# Altium schematic sheet ZynqDDR.SchDoc: =TITLE
size A3; DocumentNumber: 8; SheetNumber: 8; SheetTotal: 11
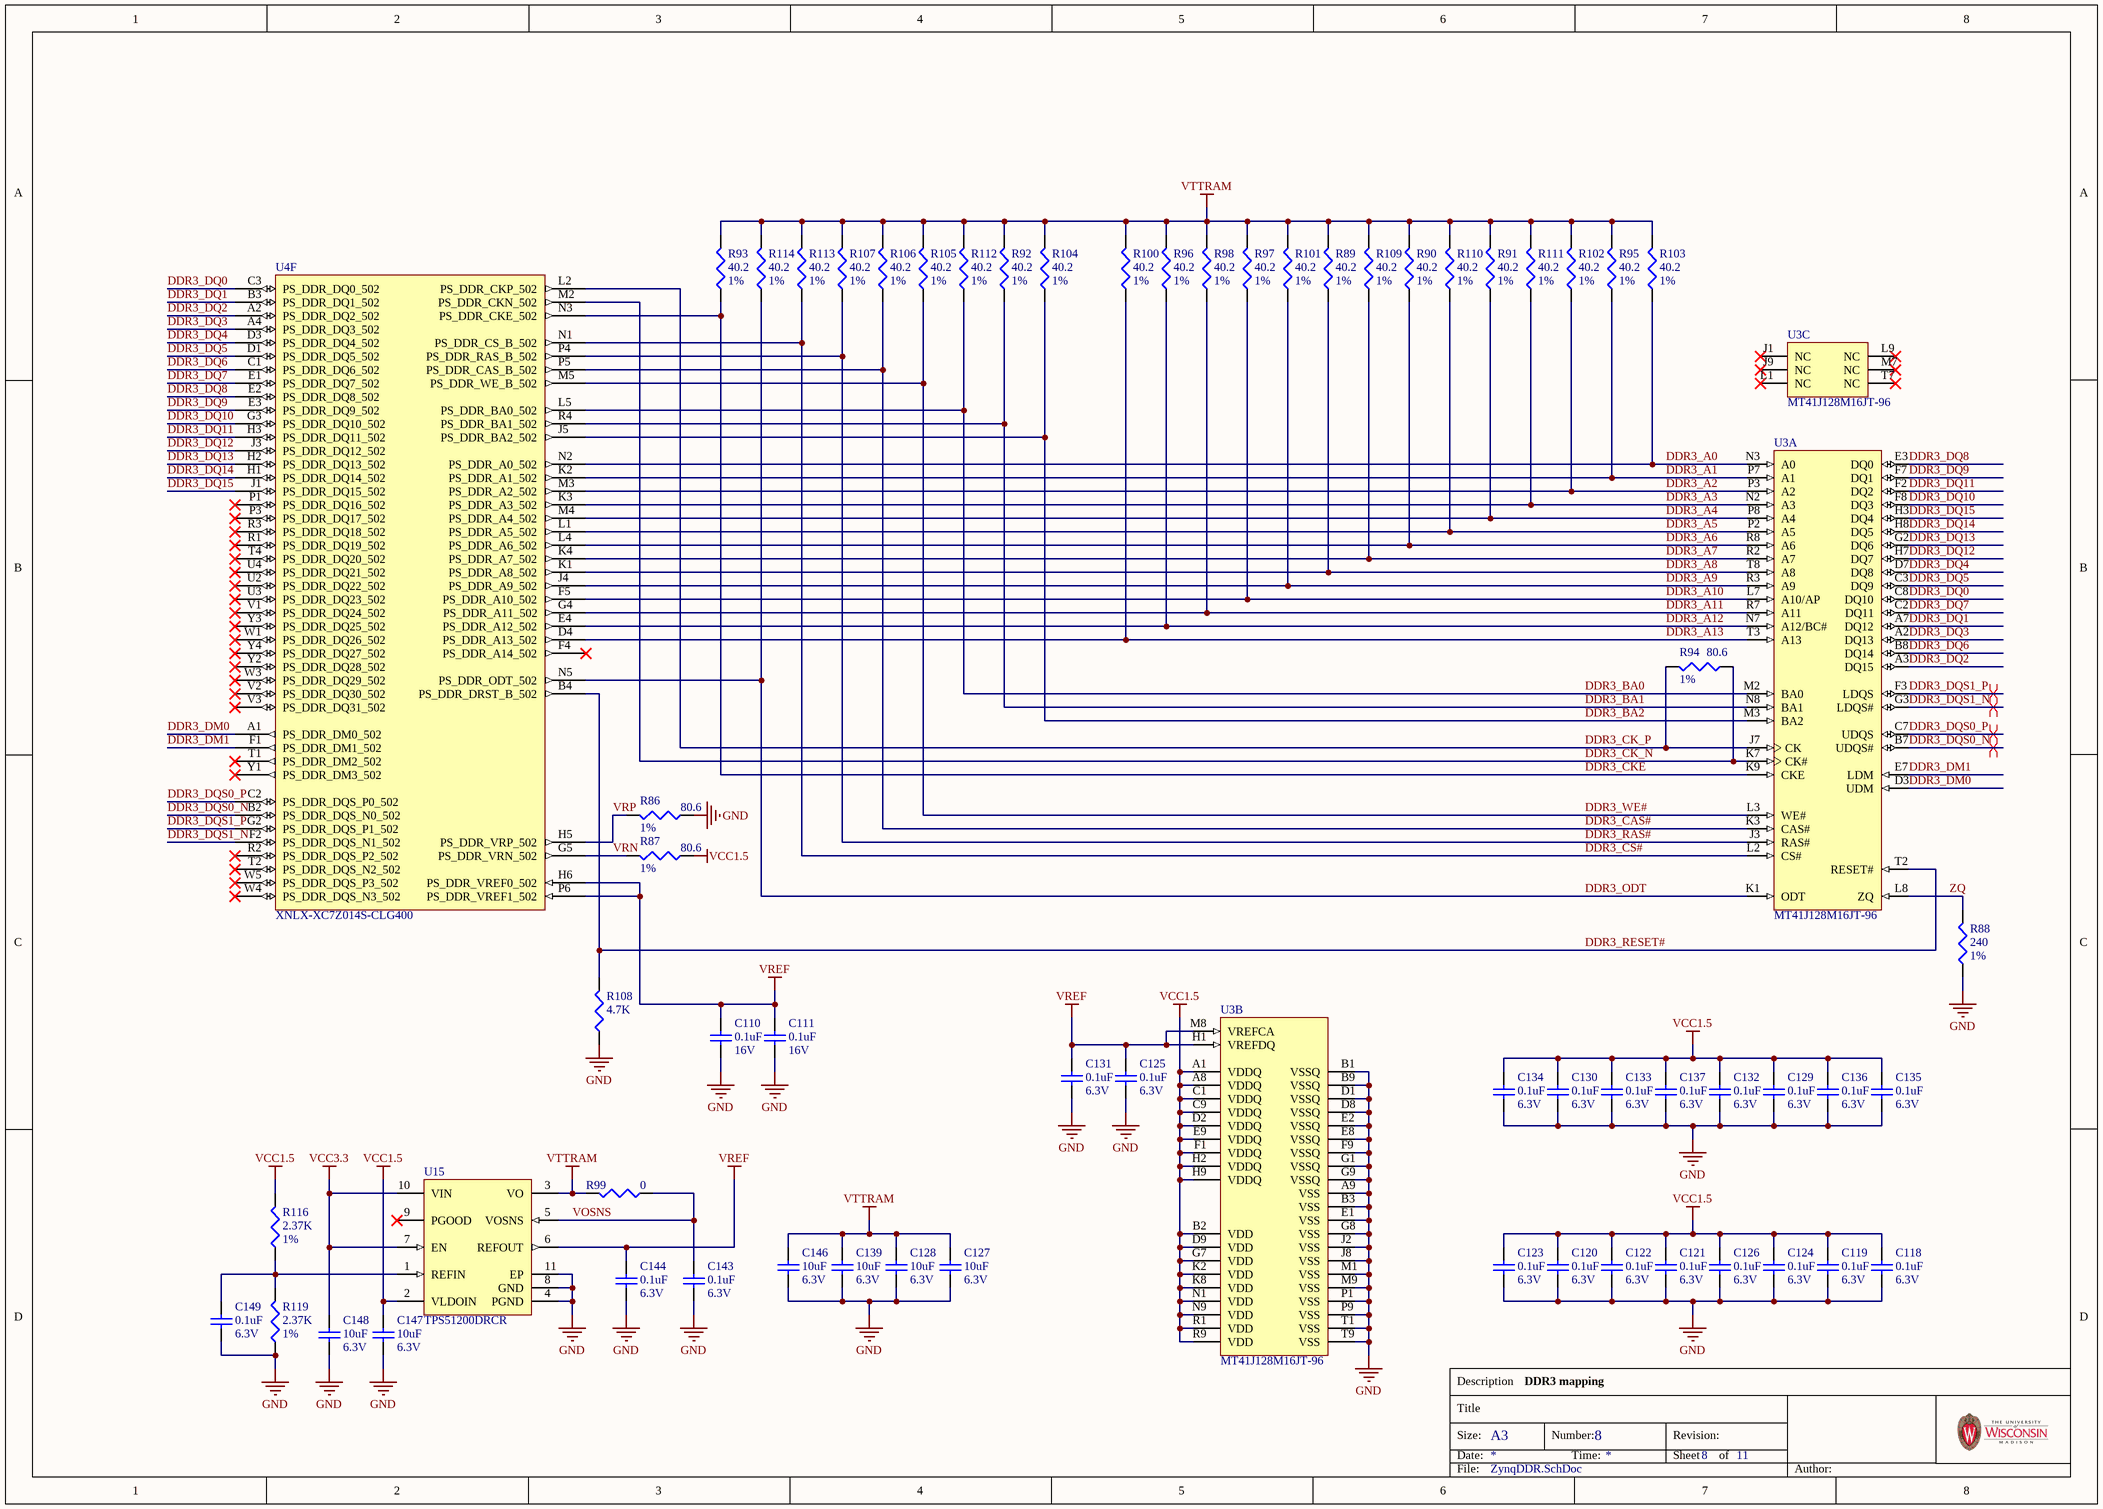
[diagram p0: ZynqDDR.SchDoc]

## Parts
C110  value 0.1uF  Rating: 16V  [C0402_IPC_H]  (hidden comment: ?)
C111  value 0.1uF  Rating: 16V  [C0402_IPC_H]  (hidden comment: ?)
C118  value 0.1uF  Rating: 6.3V  [C0201_IPC_H]  (hidden comment: ?)
C119  value 0.1uF  Rating: 6.3V  [C0201_IPC_H]  (hidden comment: ?)
C120  value 0.1uF  Rating: 6.3V  [C0201_IPC_H]  (hidden comment: ?)
C121  value 0.1uF  Rating: 6.3V  [C0201_IPC_H]  (hidden comment: ?)
C122  value 0.1uF  Rating: 6.3V  [C0201_IPC_H]  (hidden comment: ?)
C123  value 0.1uF  Rating: 6.3V  [C0201_IPC_H]  (hidden comment: ?)
C124  value 0.1uF  Rating: 6.3V  [C0201_IPC_H]  (hidden comment: ?)
C125  value 0.1uF  Rating: 6.3V  [C0201_IPC_H]  (hidden comment: ?)
C126  value 0.1uF  Rating: 6.3V  [C0201_IPC_H]  (hidden comment: ?)
C127  value 10uF  Rating: 6.3V  [C0402_IPC_H]  (hidden comment: ?)
C128  value 10uF  Rating: 6.3V  [C0402_IPC_H]  (hidden comment: ?)
C129  value 0.1uF  Rating: 6.3V  [C0201_IPC_H]  (hidden comment: ?)
C130  value 0.1uF  Rating: 6.3V  [C0201_IPC_H]  (hidden comment: ?)
C131  value 0.1uF  Rating: 6.3V  [C0201_IPC_H]  (hidden comment: ?)
C132  value 0.1uF  Rating: 6.3V  [C0201_IPC_H]  (hidden comment: ?)
C133  value 0.1uF  Rating: 6.3V  [C0201_IPC_H]  (hidden comment: ?)
C134  value 0.1uF  Rating: 6.3V  [C0201_IPC_H]  (hidden comment: ?)
C135  value 0.1uF  Rating: 6.3V  [C0201_IPC_H]  (hidden comment: ?)
C136  value 0.1uF  Rating: 6.3V  [C0201_IPC_H]  (hidden comment: ?)
C137  value 0.1uF  Rating: 6.3V  [C0201_IPC_H]  (hidden comment: ?)
C139  value 10uF  Rating: 6.3V  [C0402_IPC_H]  (hidden comment: ?)
C143  value 0.1uF  Rating: 6.3V  [C0201_IPC_H]  (hidden comment: ?)
C144  value 0.1uF  Rating: 6.3V  [C0201_IPC_H]  (hidden comment: ?)
C146  value 10uF  Rating: 6.3V  [C0402_IPC_H]  (hidden comment: ?)
C147  value 10uF  Rating: 6.3V  [C0402_IPC_H]  (hidden comment: ?)
C148  value 10uF  Rating: 6.3V  [C0402_IPC_H]  (hidden comment: ?)
C149  value 0.1uF  Rating: 6.3V  [C0201_IPC_H]  (hidden comment: ?)
R86  value 80.6  Tolerance: 1%  [R0402_IPC_H]  (hidden comment: ?)
R87  value 80.6  Tolerance: 1%  [R0402_IPC_H]  (hidden comment: ?)
R88  value 240  Tolerance: 1%  [R0402_IPC_H]  (hidden comment: ?)
R89  value 40.2  Tolerance: 1%  [R0201_IPC_H]  (hidden comment: ?)
R90  value 40.2  Tolerance: 1%  [R0201_IPC_H]  (hidden comment: ?)
R91  value 40.2  Tolerance: 1%  [R0201_IPC_H]  (hidden comment: ?)
R92  value 40.2  Tolerance: 1%  [R0201_IPC_H]  (hidden comment: ?)
R93  value 40.2  Tolerance: 1%  [R0201_IPC_H]  (hidden comment: ?)
R94  value 80.6  Tolerance: 1%  [R0402_IPC_H]  (hidden comment: ?)
R95  value 40.2  Tolerance: 1%  [R0201_IPC_H]  (hidden comment: ?)
R96  value 40.2  Tolerance: 1%  [R0201_IPC_H]  (hidden comment: ?)
R97  value 40.2  Tolerance: 1%  [R0201_IPC_H]  (hidden comment: ?)
R98  value 40.2  Tolerance: 1%  [R0201_IPC_H]  (hidden comment: ?)
R99  value 0  [R0402_IPC_H]  (hidden comment: ?)
R100  value 40.2  Tolerance: 1%  [R0201_IPC_H]  (hidden comment: ?)
R101  value 40.2  Tolerance: 1%  [R0201_IPC_H]  (hidden comment: ?)
R102  value 40.2  Tolerance: 1%  [R0201_IPC_H]  (hidden comment: ?)
R103  value 40.2  Tolerance: 1%  [R0201_IPC_H]  (hidden comment: ?)
R104  value 40.2  Tolerance: 1%  [R0201_IPC_H]  (hidden comment: ?)
R105  value 40.2  Tolerance: 1%  [R0201_IPC_H]  (hidden comment: ?)
R106  value 40.2  Tolerance: 1%  [R0201_IPC_H]  (hidden comment: ?)
R107  value 40.2  Tolerance: 1%  [R0201_IPC_H]  (hidden comment: ?)
R108  value 4.7K  [R0402_IPC_H]  (hidden comment: ?)
R109  value 40.2  Tolerance: 1%  [R0201_IPC_H]  (hidden comment: ?)
R110  value 40.2  Tolerance: 1%  [R0201_IPC_H]  (hidden comment: ?)
R111  value 40.2  Tolerance: 1%  [R0201_IPC_H]  (hidden comment: ?)
R112  value 40.2  Tolerance: 1%  [R0201_IPC_H]  (hidden comment: ?)
R113  value 40.2  Tolerance: 1%  [R0201_IPC_H]  (hidden comment: ?)
R114  value 40.2  Tolerance: 1%  [R0201_IPC_H]  (hidden comment: ?)
R116  value 2.37K  Tolerance: 1%  [R0402_IPC_H]  (hidden comment: ?)
R119  value 2.37K  Tolerance: 1%  [R0402_IPC_H]  (hidden comment: ?)
U3  MT41J128M16JT-96  [MICT-JT-96]  (parts A,B,C of 3)
U4  XNLX-XC7Z014S-CLG400  [CLG400]  (part F of 9)
U15  TPS51200DRCR  [DRC0010J_V]

## Nets
GND: C110.1 C111.1 C118.2 C119.2 C120.2 C121.2 C122.2 C123.2 C124.2 C125.1 C126.2 C127.1 C128.1 C129.2 C130.2 C131.1 C132.2 C133.2 C134.2 C135.2 C136.2 C137.2 C139.1 C143.1 C144.1 C146.1 C147.1 C148.1 C149.1 R86.1 R88.1 R108.1 R119.1 U3.A9(VSS) U3.B1(VSSQ) U3.B3(VSS) U3.B9(VSSQ) U3.D1(VSSQ) U3.D8(VSSQ) U3.E1(VSS) U3.E2(VSSQ) U3.E8(VSSQ) U3.F9(VSSQ) U3.G1(VSSQ) U3.G8(VSS) U3.G9(VSSQ) U3.J2(VSS) U3.J8(VSS) U3.M1(VSS) U3.M9(VSS) U3.P1(VSS) U3.P9(VSS) U3.T1(VSS) U3.T9(VSS) U15.4(PGND) U15.8(GND) U15.11(EP)
VCC1.5: C118.1 C119.1 C120.1 C121.1 C122.1 C123.1 C124.1 C126.1 C129.1 C130.1 C132.1 C133.1 C134.1 C135.1 C136.1 C137.1 C147.2 R87.1 R116.2 U3.A1(VDDQ) U3.A8(VDDQ) U3.B2(VDD) U3.C1(VDDQ) U3.C9(VDDQ) U3.D2(VDDQ) U3.D9(VDD) U3.E9(VDDQ) U3.F1(VDDQ) U3.G7(VDD) U3.H2(VDDQ) U3.H9(VDDQ) U3.K2(VDD) U3.K8(VDD) U3.N1(VDD) U3.N9(VDD) U3.R1(VDD) U3.R9(VDD) U15.2(VLDOIN)
VCC3.3: C148.2 U15.7(EN) U15.10(VIN)
VREF: C110.2 C111.2 C125.2 C131.2 C144.2 U3.H1(VREFDQ) U3.M8(VREFCA) U4.H6(PS_DDR_VREF0_502) U4.P6(PS_DDR_VREF1_502) U15.6(REFOUT)
VTTRAM: C127.2 C128.2 C139.2 C146.2 R89.2 R90.2 R91.2 R92.2 R93.2 R95.2 R96.2 R97.2 R98.2 R99.2 R100.2 R101.2 R102.2 R103.2 R104.2 R105.2 R106.2 R107.2 R109.2 R110.2 R111.2 R112.2 R113.2 R114.2 U15.3(VO)
DDR3_A0: R103.1 U3.N3(A0) U4.N2(PS_DDR_A0_502)
DDR3_A1: R95.1 U3.P7(A1) U4.K2(PS_DDR_A1_502)
DDR3_A2: R102.1 U3.P3(A2) U4.M3(PS_DDR_A2_502)
DDR3_A3: R111.1 U3.N2(A3) U4.K3(PS_DDR_A3_502)
DDR3_A4: R91.1 U3.P8(A4) U4.M4(PS_DDR_A4_502)
DDR3_A5: R110.1 U3.P2(A5) U4.L1(PS_DDR_A5_502)
DDR3_A6: R90.1 U3.R8(A6) U4.L4(PS_DDR_A6_502)
DDR3_A7: R109.1 U3.R2(A7) U4.K4(PS_DDR_A7_502)
DDR3_A8: R89.1 U3.T8(A8) U4.K1(PS_DDR_A8_502)
DDR3_A9: R101.1 U3.R3(A9) U4.J4(PS_DDR_A9_502)
DDR3_A10: R97.1 U3.L7(A10/AP) U4.F5(PS_DDR_A10_502)
DDR3_A11: R98.1 U3.R7(A11) U4.G4(PS_DDR_A11_502)
DDR3_A12: R96.1 U3.N7(A12/BC#) U4.E4(PS_DDR_A12_502)
DDR3_A13: R100.1 U3.T3(A13) U4.D4(PS_DDR_A13_502)
DDR3_BA0: R112.1 U3.M2(BA0) U4.L5(PS_DDR_BA0_502)
DDR3_BA1: R92.1 U3.N8(BA1) U4.R4(PS_DDR_BA1_502)
DDR3_BA2: R104.1 U3.M3(BA2) U4.J5(PS_DDR_BA2_502)
DDR3_CAS#: R106.1 U3.K3(CAS#) U4.P5(PS_DDR_CAS_B_502)
DDR3_CK_N: R94.1 U3.K7(CK#) U4.M2(PS_DDR_CKN_502)
DDR3_CK_P: R94.2 U3.J7(CK) U4.L2(PS_DDR_CKP_502)
DDR3_CKE: R93.1 U3.K9(CKE) U4.N3(PS_DDR_CKE_502)
DDR3_CS#: R113.1 U3.L2(CS#) U4.N1(PS_DDR_CS_B_502)
DDR3_DM0: U3.D3(UDM) U4.A1(PS_DDR_DM0_502)
DDR3_DM1: U3.E7(LDM) U4.F1(PS_DDR_DM1_502)
DDR3_DQ0: U3.C8(DQ10) U4.C3(PS_DDR_DQ0_502)
DDR3_DQ1: U3.A7(DQ12) U4.B3(PS_DDR_DQ1_502)
DDR3_DQ2: U3.A3(DQ15) U4.A2(PS_DDR_DQ2_502)
DDR3_DQ3: U3.A2(DQ13) U4.A4(PS_DDR_DQ3_502)
DDR3_DQ4: U3.D7(DQ8) U4.D3(PS_DDR_DQ4_502)
DDR3_DQ5: U3.C3(DQ9) U4.D1(PS_DDR_DQ5_502)
DDR3_DQ6: U3.B8(DQ14) U4.C1(PS_DDR_DQ6_502)
DDR3_DQ7: U3.C2(DQ11) U4.E1(PS_DDR_DQ7_502)
DDR3_DQ8: U3.E3(DQ0) U4.E2(PS_DDR_DQ8_502)
DDR3_DQ9: U3.F7(DQ1) U4.E3(PS_DDR_DQ9_502)
DDR3_DQ10: U3.F8(DQ3) U4.G3(PS_DDR_DQ10_502)
DDR3_DQ11: U3.F2(DQ2) U4.H3(PS_DDR_DQ11_502)
DDR3_DQ12: U3.H7(DQ7) U4.J3(PS_DDR_DQ12_502)
DDR3_DQ13: U3.G2(DQ6) U4.H2(PS_DDR_DQ13_502)
DDR3_DQ14: U3.H8(DQ5) U4.H1(PS_DDR_DQ14_502)
DDR3_DQ15: U3.H3(DQ4) U4.J1(PS_DDR_DQ15_502)
DDR3_DQS0_N: U3.B7(UDQS#) U4.B2(PS_DDR_DQS_N0_502)
DDR3_DQS0_P: U3.C7(UDQS) U4.C2(PS_DDR_DQS_P0_502)
DDR3_DQS1_N: U3.G3(LDQS#) U4.F2(PS_DDR_DQS_N1_502)
DDR3_DQS1_P: U3.F3(LDQS) U4.G2(PS_DDR_DQS_P1_502)
DDR3_ODT: R114.1 U3.K1(ODT) U4.N5(PS_DDR_ODT_502)
DDR3_RAS#: R107.1 U3.J3(RAS#) U4.P4(PS_DDR_RAS_B_502)
DDR3_RESET#: R108.2 U3.T2(RESET#) U4.B4(PS_DDR_DRST_B_502)
DDR3_WE#: R105.1 U3.L3(WE#) U4.M5(PS_DDR_WE_B_502)
VOSNS: C143.2 R99.1 U15.5(VOSNS)
VRN: R87.2 U4.G5(PS_DDR_VRN_502)
VRP: R86.2 U4.H5(PS_DDR_VRP_502)
ZQ: R88.2 U3.L8(ZQ)
NetC149_2: C149.2 R116.1 R119.2 U15.1(REFIN)

Not connected (* = marked no-connect by the designer): U3 J1(NC)* J9(NC)* L1(NC)* L9(NC)* M7(NC)* T7(NC)*; U4 F4(PS_DDR_A14_502)* P1(PS_DDR_DQ16_502)* P3(PS_DDR_DQ17_502)* R1(PS_DDR_DQ19_502)* R2(PS_DDR_DQS_P2_502)* R3(PS_DDR_DQ18_502)* T1(PS_DDR_DM2_502)* T2(PS_DDR_DQS_N2_502)* T4(PS_DDR_DQ20_502)* U2(PS_DDR_DQ22_502)* U3(PS_DDR_DQ23_502)* U4(PS_DDR_DQ21_502)* V1(PS_DDR_DQ24_502)* V2(PS_DDR_DQ30_502)* V3(PS_DDR_DQ31_502)* W1(PS_DDR_DQ26_502)* W3(PS_DDR_DQ29_502)* W4(PS_DDR_DQS_N3_502)* W5(PS_DDR_DQS_P3_502)* Y1(PS_DDR_DM3_502)* Y2(PS_DDR_DQ28_502)* Y3(PS_DDR_DQ25_502)* Y4(PS_DDR_DQ27_502)*; U15 9(PGOOD)*

## Layout directives
differential pair: DDR3_DQS0_N, DDR3_DQS0_P, DDR3_DQS1_N, DDR3_DQS1_P

## Notes on the sheet
- DDR3 mapping
- Description
- Title
- Size:
- Date:
- A3
- Number:
- Time:
- Revision:
- Sheet
- of
- File:
- Author:

## Library data of the parts
C110 C111 = Cap: Capacitor; Manufacturer: Murata; Part: GRM155R71C104KA88D; INVKEY: CP0402-0.1UF-16V-10%; PackageDescription: Chip Capacitor
C118-C126 C129-C137 C143 C144 C149 = Cap: Capacitor; Manufacturer: Murata; Part: GRM033R60J104KE19D; INVKEY: CP0201-0.1UF-6.3V-10%; PackageDescription: Chip Capacitor
C127 C128 C139 C146-C148 = Cap: Capacitor; Manufacturer: Murata; Part: GRM155R60J106ME44D; INVKEY: CP0402-10UF-6V3-20%; PackageDescription: Chip Capacitor
R86 R87 R94 = Res: Resistor; Manufacturer: Panasonic-ECG; Part: ERJ-2RKF80R6X; INVKEY: RS0402-80R6-1/10W-1%; PackageDescription: Chip Resistor
R88 = Res: Resistor; Manufacturer: Panasonic-ECG; Part: ERJ-2RKF2400X; INVKEY: RS0402-240R-1/10W-1%; PackageDescription: Chip Resistor
R89-R93 R95-R98 R100-R107 R109-R114 = Res: Resistor; Manufacturer: Panasonic-ECG; Part: ERJ-1GEF40R2C; INVKEY: RS0201-40R2-1/20W-1%; PackageDescription: Chip Resistor
R99 = Res: Resistor; Manufacturer: Panasonic-ECG; Part: ERJ-2GE0R00X; Tolerance: 5%; INVKEY: RS0402-0R-1/10W-5%; PackageDescription: Chip Resistor
R108 = Res: Resistor; Manufacturer: Panasonic; Part: ERJ-2RKF4701X; Tolerance: 1%; INVKEY: RS0402-4K7-1/10W-1%; PackageDescription: Chip Resistor
R116 R119 = Res: Resistor; Manufacturer: Panasonic; Part: ERJ-2RKF2371X; INVKEY: RS0402-2K37-1/10W-1%; PackageDescription: Chip Resistor
U3 = MT41J128M16JT-96: Manufacturer: Micron; Part: MT41J128M16JT-125; Note: Any speed grade will work; INVKEY: IC-DRAM-MT41J-2GB-JT
U4 = XNLX-XC7Z020-CLG400: Manufacturer: Xilinx; Part: XC7Z014S-1CLG400C; INVKEY: ?
U15 = CMP-0395-00664-2: Single Output LDO, 3 A, 2.375 to 3.5 V Input, with DDR Termination, 10-pin SON (DRC), -40 to 85 degC, Green (RoHS & no Sb/Br); Manufacturer: Texas Instruments; Vin(Min)(V): 2.3; Vin(Max)(V): 3.5; SubFamily: Single Channel LDO; Iout(Max)(A): 3; Power Good: TRUE; Iq(Typ)(mA): 0.5; Rating: Catalog; INVKEY: IC-DDRTERM-REG-PPSON10; ComponentLink1URL: http://www.ti.com/; ComponentLink3URL: http://www.ti.com/litv/pdf/mpds117k; PackageVersion: 4204102-3/L; Mounting Technology: Surface Mount; DatasheetVersion: SLUS812; Eco-Plan: Green (RoHS & no Sb/Br); ComponentLink4URL: Samples URL:http://www.ti.com/product/tps51200#samples; ComponentLink3Description: Package Specification; PackageReference: DRC0010J; ComponentLink2URL: http://www.ti.com/general/docs/lit/getliterature.tsp?genericPartNumber=TPS51200&fileType=pdf; ComponentLink2Description: Datasheet; PartNumber: TPS51200DRCR; PackageDescription: 10-Pin Plastic Small Outline, Body 3 x 3 mm, Pitch 0.5 mm; ComponentLink4Description: URL Link1; ComponentLink1Description: Manufacturer URL; Part: TPS51200DRCR